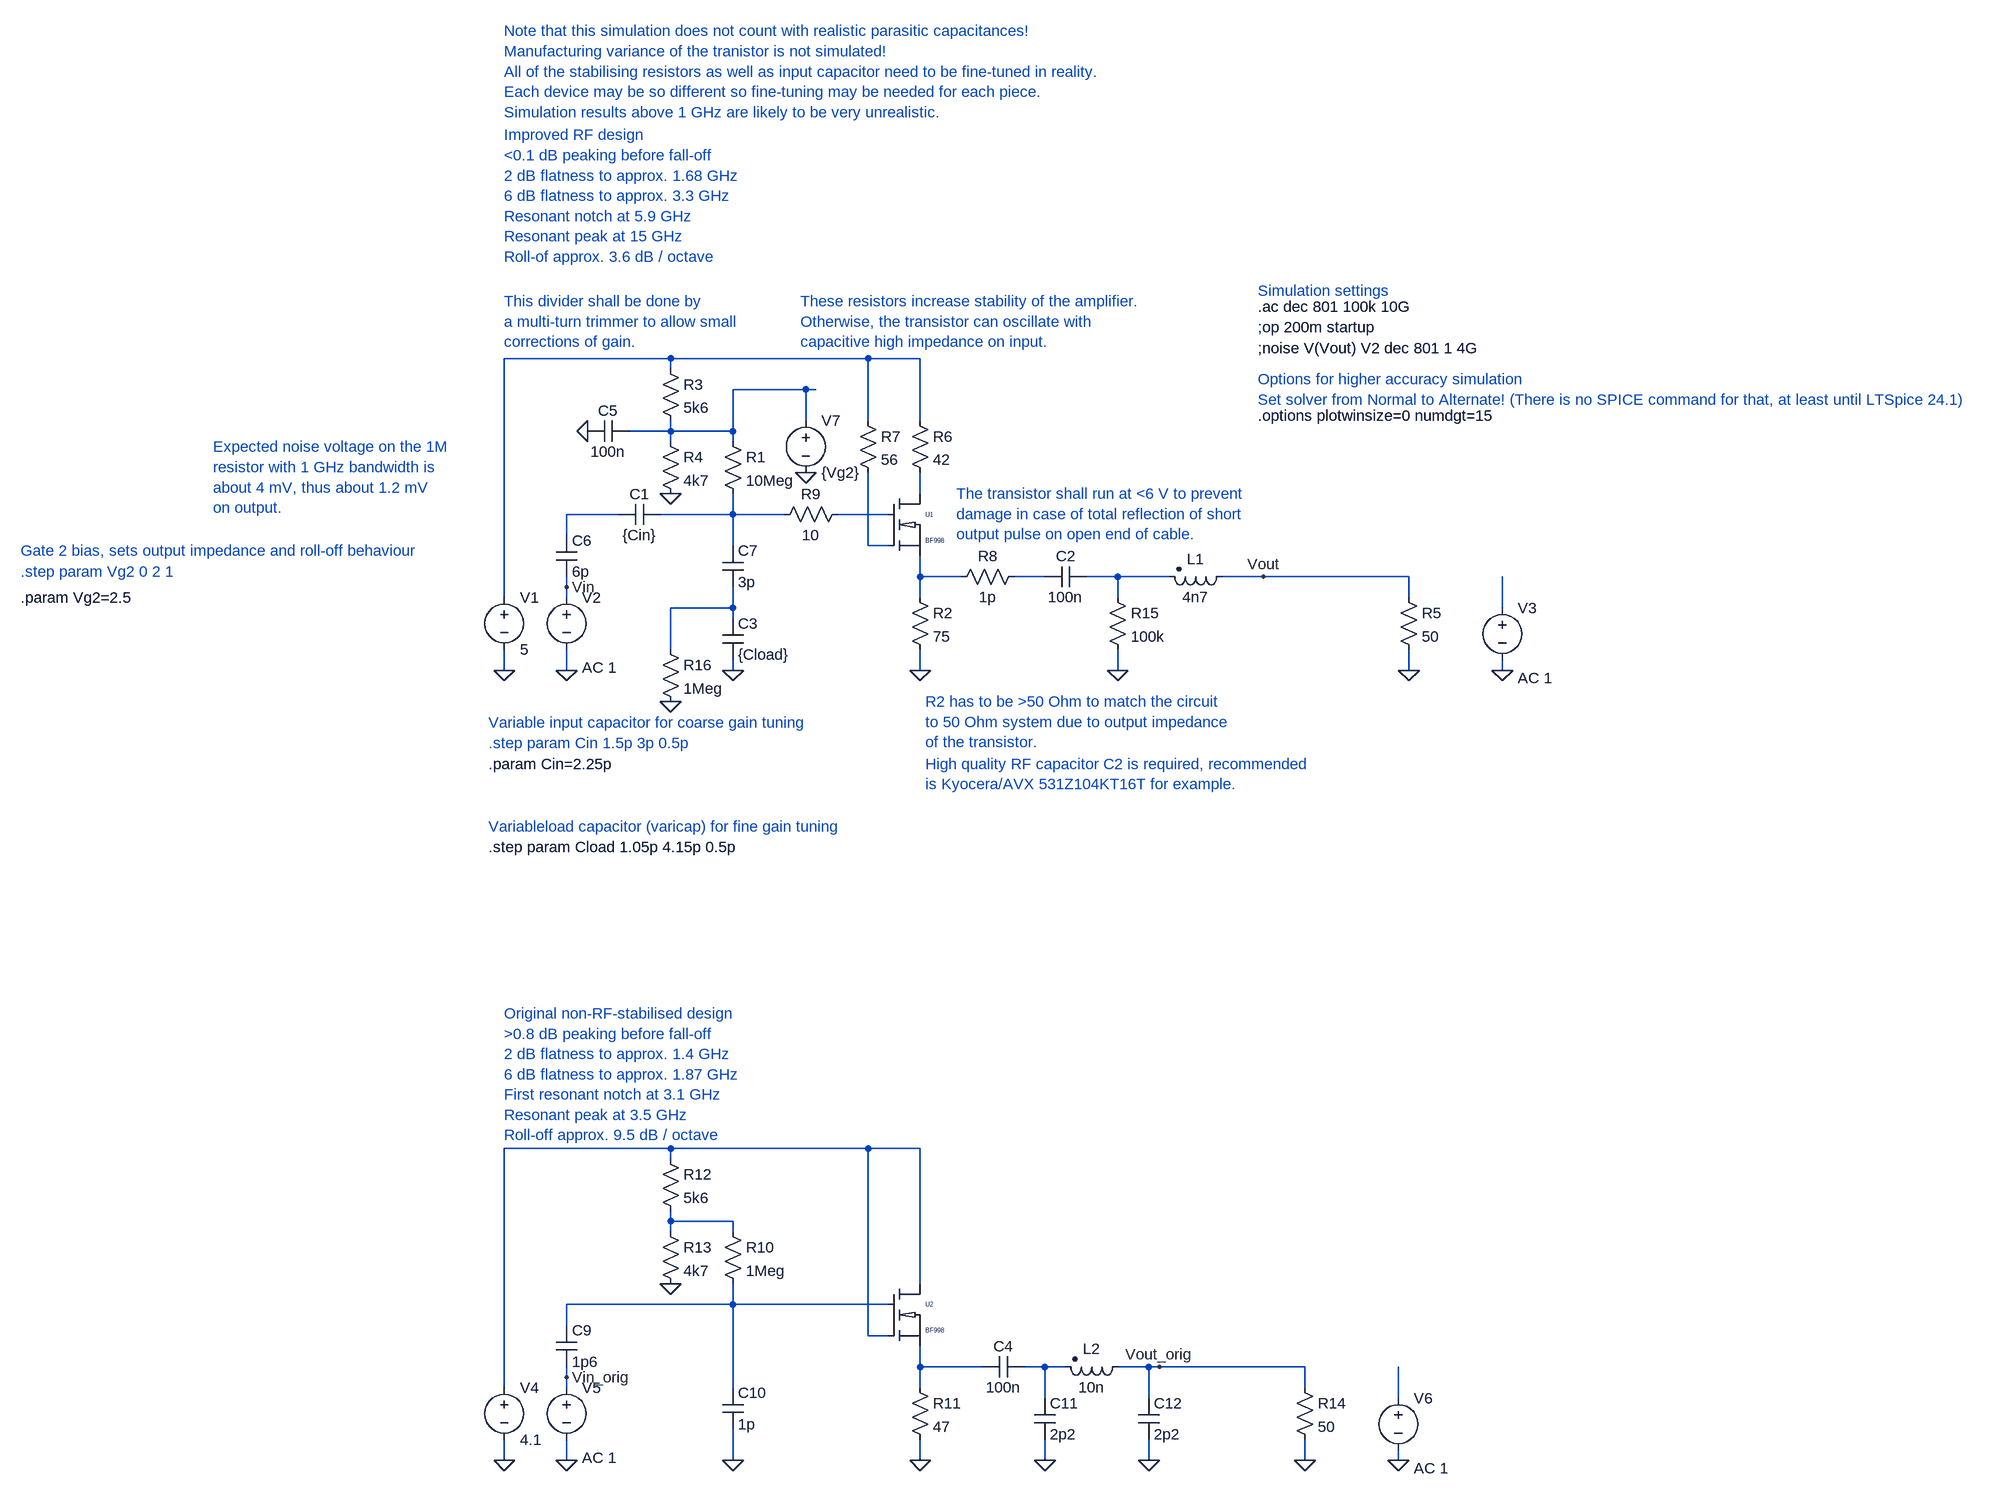
[diagram p0: schematic probe.asc]
probe.asc, the LTspice schematic file:
Version 4
SHEET 1 2160 1692
WIRE -32 -32 -288 -32
WIRE 272 -32 -32 -32
WIRE 352 -32 272 -32
WIRE -32 -16 -32 -32
WIRE 176 16 64 16
WIRE 192 16 176 16
WIRE 176 64 176 16
WIRE 272 64 272 -32
WIRE 352 64 352 -32
WIRE -32 80 -32 64
WIRE -32 80 -96 80
WIRE 64 80 64 16
WIRE 64 80 -32 80
WIRE -32 96 -32 80
WIRE 64 96 64 80
WIRE 352 176 352 144
WIRE -112 208 -192 208
WIRE 64 208 64 176
WIRE 64 208 -48 208
WIRE 144 208 64 208
WIRE 304 208 224 208
WIRE -192 240 -192 208
WIRE 64 256 64 208
WIRE 272 256 272 144
WIRE 304 256 272 256
WIRE 352 304 352 272
WIRE 416 304 352 304
WIRE 544 304 496 304
WIRE 656 304 608 304
WIRE 736 304 656 304
WIRE 880 304 816 304
WIRE 1104 304 880 304
WIRE -192 320 -192 304
WIRE -288 336 -288 -32
WIRE -192 336 -192 320
WIRE 352 336 352 304
WIRE 656 336 656 304
WIRE 1104 336 1104 304
WIRE 64 352 64 320
WIRE 64 352 -32 352
WIRE 1248 352 1248 304
WIRE 64 368 64 352
WIRE -32 416 -32 352
WIRE -288 448 -288 416
WIRE -192 448 -192 416
WIRE 64 448 64 432
WIRE 352 448 352 416
WIRE 656 448 656 416
WIRE 1104 448 1104 416
WIRE 1248 448 1248 432
WIRE -32 1184 -288 1184
WIRE 272 1184 -32 1184
WIRE 352 1184 272 1184
WIRE -32 1200 -32 1184
WIRE -32 1296 -32 1280
WIRE 64 1296 -32 1296
WIRE -32 1312 -32 1296
WIRE 64 1312 64 1296
WIRE 352 1392 352 1184
WIRE 64 1424 64 1392
WIRE 64 1424 -192 1424
WIRE 304 1424 64 1424
WIRE -192 1456 -192 1424
WIRE 272 1472 272 1184
WIRE 304 1472 272 1472
WIRE 352 1520 352 1488
WIRE 448 1520 352 1520
WIRE 544 1520 512 1520
WIRE 576 1520 544 1520
WIRE 704 1520 656 1520
WIRE 720 1520 704 1520
WIRE 944 1520 720 1520
WIRE -192 1536 -192 1520
WIRE -288 1552 -288 1184
WIRE -192 1552 -192 1536
WIRE 64 1552 64 1424
WIRE 352 1552 352 1520
WIRE 944 1552 944 1520
WIRE 544 1568 544 1520
WIRE 704 1568 704 1520
WIRE 1088 1568 1088 1520
WIRE -288 1664 -288 1632
WIRE -192 1664 -192 1632
WIRE 64 1664 64 1616
WIRE 352 1664 352 1632
WIRE 544 1664 544 1632
WIRE 704 1664 704 1632
WIRE 944 1664 944 1632
WIRE 1088 1664 1088 1648
FLAG -288 448 0
FLAG -192 448 0
FLAG 352 448 0
FLAG -32 176 0
FLAG 880 304 Vout
FLAG -192 320 Vin
FLAG 1104 448 0
FLAG 1248 448 0
FLAG -160 80 0
FLAG 64 448 0
FLAG -288 1664 0
FLAG -192 1664 0
FLAG 352 1664 0
FLAG -32 1392 0
FLAG 720 1520 Vout_orig
FLAG -192 1536 Vin_orig
FLAG 944 1664 0
FLAG 1088 1664 0
FLAG 64 1664 0
FLAG 704 1664 0
FLAG 544 1664 0
FLAG 656 448 0
FLAG -32 496 0
FLAG 176 144 0
SYMBOL BF998 304 176 R0
SYMATTR InstName U1
SYMBOL voltage -288 320 R0
WINDOW 123 0 0 Left 0
WINDOW 39 0 0 Left 0
SYMATTR InstName V1
SYMATTR Value 5
SYMBOL voltage -192 320 R0
WINDOW 123 24 124 Left 2
WINDOW 39 0 0 Left 0
SYMATTR Value2 AC 1
SYMATTR InstName V2
SYMATTR Value ""
SYMBOL cap -48 192 R90
WINDOW 0 0 32 VBottom 2
WINDOW 3 32 32 VTop 2
SYMATTR InstName C1
SYMATTR Value {Cin}
SYMBOL res 48 80 R0
SYMATTR InstName R1
SYMATTR Value 10Meg
SYMBOL res 336 320 R0
SYMATTR InstName R2
SYMATTR Value 75
SYMBOL cap 608 288 R90
WINDOW 0 0 32 VBottom 2
WINDOW 3 32 32 VTop 2
SYMATTR InstName C2
SYMATTR Value 100n
SYMBOL res -48 -32 R0
SYMATTR InstName R3
SYMATTR Value 5k6
SYMBOL res -48 80 R0
SYMATTR InstName R4
SYMATTR Value 4k7
SYMBOL ind2 832 288 R90
WINDOW 0 4 56 VBottom 2
WINDOW 3 32 56 VTop 2
SYMATTR InstName L1
SYMATTR Value 4n7
SYMATTR Type ind
SYMBOL res 1088 320 R0
SYMATTR InstName R5
SYMATTR Value 50
SYMBOL voltage 1248 336 R0
WINDOW 123 24 124 Left 2
WINDOW 39 0 0 Left 0
SYMATTR Value2 AC 1
SYMATTR InstName V3
SYMATTR Value ""
SYMBOL cap -96 64 R90
WINDOW 0 0 32 VBottom 2
WINDOW 3 32 32 VTop 2
SYMATTR InstName C5
SYMATTR Value 100n
SYMBOL res 336 48 R0
SYMATTR InstName R6
SYMATTR Value 42
SYMBOL res 256 48 R0
SYMATTR InstName R7
SYMATTR Value 56
SYMBOL res 512 288 R90
WINDOW 0 0 56 VBottom 2
WINDOW 3 32 56 VTop 2
SYMATTR InstName R8
SYMATTR Value 1p
SYMBOL cap -208 240 R0
SYMATTR InstName C6
SYMATTR Value 6p
SYMBOL cap 48 256 R0
SYMATTR InstName C7
SYMATTR Value 3p
SYMBOL res 240 192 R90
WINDOW 0 0 56 VBottom 2
WINDOW 3 32 56 VTop 2
SYMATTR InstName R9
SYMATTR Value 10
SYMBOL BF998 304 1392 R0
SYMATTR InstName U2
SYMBOL voltage -288 1536 R0
WINDOW 123 0 0 Left 0
WINDOW 39 0 0 Left 0
SYMATTR InstName V4
SYMATTR Value 4.1
SYMBOL voltage -192 1536 R0
WINDOW 123 24 124 Left 2
WINDOW 39 0 0 Left 0
SYMATTR Value2 AC 1
SYMATTR InstName V5
SYMATTR Value ""
SYMBOL res 48 1296 R0
SYMATTR InstName R10
SYMATTR Value 1Meg
SYMBOL res 336 1536 R0
SYMATTR InstName R11
SYMATTR Value 47
SYMBOL cap 512 1504 R90
WINDOW 0 0 32 VBottom 2
WINDOW 3 32 32 VTop 2
SYMATTR InstName C4
SYMATTR Value 100n
SYMBOL res -48 1184 R0
SYMATTR InstName R12
SYMATTR Value 5k6
SYMBOL res -48 1296 R0
SYMATTR InstName R13
SYMATTR Value 4k7
SYMBOL ind2 672 1504 R90
WINDOW 0 4 56 VBottom 2
WINDOW 3 32 56 VTop 2
SYMATTR InstName L2
SYMATTR Value 10n
SYMATTR Type ind
SYMBOL res 928 1536 R0
SYMATTR InstName R14
SYMATTR Value 50
SYMBOL voltage 1088 1552 R0
WINDOW 123 24 124 Left 2
WINDOW 39 0 0 Left 0
SYMATTR Value2 AC 1
SYMATTR InstName V6
SYMATTR Value ""
SYMBOL cap -208 1456 R0
SYMATTR InstName C9
SYMATTR Value 1p6
SYMBOL cap 48 1552 R0
SYMATTR InstName C10
SYMATTR Value 1p
SYMBOL cap 528 1568 R0
SYMATTR InstName C11
SYMATTR Value 2p2
SYMBOL cap 688 1568 R0
SYMATTR InstName C12
SYMATTR Value 2p2
SYMBOL res 640 320 R0
SYMATTR InstName R15
SYMATTR Value 100k
SYMBOL cap 48 368 R0
SYMATTR InstName C3
SYMATTR Value {Cload}
SYMBOL res -48 400 R0
SYMATTR InstName R16
SYMATTR Value 1Meg
SYMBOL voltage 176 48 R0
WINDOW 123 0 0 Left 0
WINDOW 39 0 0 Left 0
SYMATTR InstName V7
SYMATTR Value {Vg2}
TEXT 872 -80 Left 2 !;op 200m startup
TEXT 872 -112 Left 2 !.ac dec 801 100k 10G
TEXT -312 560 Left 2 ;.step param Cin 1.5p 3p 0.5p
TEXT 872 56 Left 2 !.options plotwinsize=0 numdgt=15
TEXT 872 0 Left 2 ;Options for higher accuracy simulation\nSet solver from Normal to Alternate! (There is no SPICE command for that, at least until LTSpice 24.1)
TEXT 872 -136 Left 2 ;Simulation settings
TEXT -312 528 Left 2 ;Variable input capacitor for coarse gain tuning
TEXT 168 -120 Left 2 ;These resistors increase stability of the amplifier.\nOtherwise, the transistor can oscillate with\ncapacitive high impedance on input.
TEXT -312 592 Left 2 !.param Cin=2.25p
TEXT -288 -120 Left 2 ;This divider shall be done by\na multi-turn trimmer to allow small\ncorrections of gain.
TEXT 408 176 Left 2 ;The transistor shall run at <6 V to prevent\ndamage in case of total reflection of short\noutput pulse on open end of cable.
TEXT 360 496 Left 2 ;R2 has to be >50 Ohm to match the circuit\nto 50 Ohm system due to output impedance\nof the transistor.
TEXT -736 104 Left 2 ;Expected noise voltage on the 1M\nresistor with 1 GHz bandwidth is\nabout 4 mV, thus about 1.2 mV\non output.
TEXT -288 -536 Left 2 ;Note that this simulation does not count with realistic parasitic capacitances!\nManufacturing variance of the tranistor is not simulated!\nAll of the stabilising resistors as well as input capacitor need to be fine-tuned in reality.\nEach device may be so different so fine-tuning may be needed for each piece.\nSimulation results above 1 GHz are likely to be very unrealistic.
TEXT -288 976 Left 2 ;Original non-RF-stabilised design\n>0.8 dB peaking before fall-off\n2 dB flatness to approx. 1.4 GHz\n6 dB flatness to approx. 1.87 GHz\nFirst resonant notch at 3.1 GHz\nResonant peak at 3.5 GHz\nRoll-off approx. 9.5 dB / octave
TEXT -288 -376 Left 2 ;Improved RF design\n<0.1 dB peaking before fall-off\n2 dB flatness to approx. 1.68 GHz\n6 dB flatness to approx. 3.3 GHz\nResonant notch at 5.9 GHz\nResonant peak at 15 GHz\nRoll-of approx. 3.6 dB / octave
TEXT 360 592 Left 2 ;High quality RF capacitor C2 is required, recommended\nis Kyocera/AVX 531Z104KT16T for example.
TEXT 872 -48 Left 2 !;noise V(Vout) V2 dec 801 1 4G
TEXT -1032 296 Left 2 ;.step param Vg2 0 2 1
TEXT -312 720 Left 2 !.step param Cload 1.05p 4.15p 0.5p
TEXT -1032 336 Left 2 !.param Vg2=2.5
TEXT -312 688 Left 2 ;Variableload capacitor (varicap) for fine gain tuning
TEXT -1032 264 Left 2 ;Gate 2 bias, sets output impedance and roll-off behaviour

The netlist it stands for:
* probe.asc
XU1 N008 N003 N006 N007 BF998 BF998  ; pins S D G2 G1
V1 N001 0 5
V2 Vin 0 AC 1
C1 N005 N004 {Cin}
R1 N002 N005 10Meg
R2 N008 0 75
C2 N010 N009 100n
R3 N001 N002 5k6
R4 N002 0 4k7
L1 Vout N010 4n7
R5 Vout 0 50
V3 N012 0 AC 1
C5 N002 0 100n
R6 N001 N003 42
R7 N001 N007 56
R8 N009 N008 1p
C6 N004 Vin 6p
C7 N005 N011 3p
R9 N006 N005 10
XU2 N016 N013 N015 N013 BF998 BF998  ; pins S D G2 G1
V4 N013 0 4.1
V5 Vin_orig 0 AC 1
R10 N014 N015 1Meg
R11 N016 0 47
C4 N017 N016 100n
R12 N013 N014 5k6
R13 N014 0 4k7
L2 Vout_orig N017 10n
R14 Vout_orig 0 50
V6 N018 0 AC 1
C9 N015 Vin_orig 1p6
C10 N015 0 1p
C11 N017 0 2p2
C12 Vout_orig 0 2p2
R15 N010 0 100k
C3 N011 0 {Cload}
R16 N011 0 1Meg
V7 N002 0 {Vg2}
;op 200m startup
.ac dec 801 100k 10G
* .step param Cin 1.5p 3p 0.5p
.options plotwinsize=0 numdgt=15
* Options for higher accuracy simulation
* Set solver from Normal to Alternate! (There is no SPICE command for that, at least until LTSpice 24.1)
* Simulation settings
* Variable input capacitor for coarse gain tuning
* These resistors increase stability of the amplifier.
* Otherwise, the transistor can oscillate with
* capacitive high impedance on input.
.param Cin=2.25p
* This divider shall be done by
* a multi-turn trimmer to allow small
* corrections of gain.
* The transistor shall run at <6 V to prevent
* damage in case of total reflection of short
* output pulse on open end of cable.
* R2 has to be >50 Ohm to match the circuit
* to 50 Ohm system due to output impedance
* of the transistor.
* Expected noise voltage on the 1M
* resistor with 1 GHz bandwidth is
* about 4 mV, thus about 1.2 mV
* on output.
* Note that this simulation does not count with realistic parasitic capacitances!
* Manufacturing variance of the tranistor is not simulated!
* All of the stabilising resistors as well as input capacitor need to be fine-tuned in reality.
* Each device may be so different so fine-tuning may be needed for each piece.
* Simulation results above 1 GHz are likely to be very unrealistic.
* Original non-RF-stabilised design
* >0.8 dB peaking before fall-off
* 2 dB flatness to approx. 1.4 GHz
* 6 dB flatness to approx. 1.87 GHz
* First resonant notch at 3.1 GHz
* Resonant peak at 3.5 GHz
* Roll-off approx. 9.5 dB / octave
* Improved RF design
* <0.1 dB peaking before fall-off
* 2 dB flatness to approx. 1.68 GHz
* 6 dB flatness to approx. 3.3 GHz
* Resonant notch at 5.9 GHz
* Resonant peak at 15 GHz
* Roll-of approx. 3.6 dB / octave
* High quality RF capacitor C2 is required, recommended
* is Kyocera/AVX 531Z104KT16T for example.
;noise V(Vout) V2 dec 801 1 4G
* .step param Vg2 0 2 1
.step param Cload 1.05p 4.15p 0.5p
.param Vg2=2.5
* Variableload capacitor (varicap) for fine gain tuning
* Gate 2 bias, sets output impedance and roll-off behaviour
.lib BF998.sub
.backanno
.end